# Altium schematic sheet Top Level.SchDoc: Cypress Molson - Top Level
size C; Author: George Cosens; CompanyName: Linear Systems Ltd.; DrawnBy: G. Cosens; Engineer: G. Cosens; Organization: Linear Systems Ltd.; Address1: 1-1717 Dublin Ave.; Address2: Winnipeg, MB, Canada; Address3: R3H 0H2; DocumentNumber: LS7652; Revision: 1; SheetNumber: 01; SheetTotal: 12
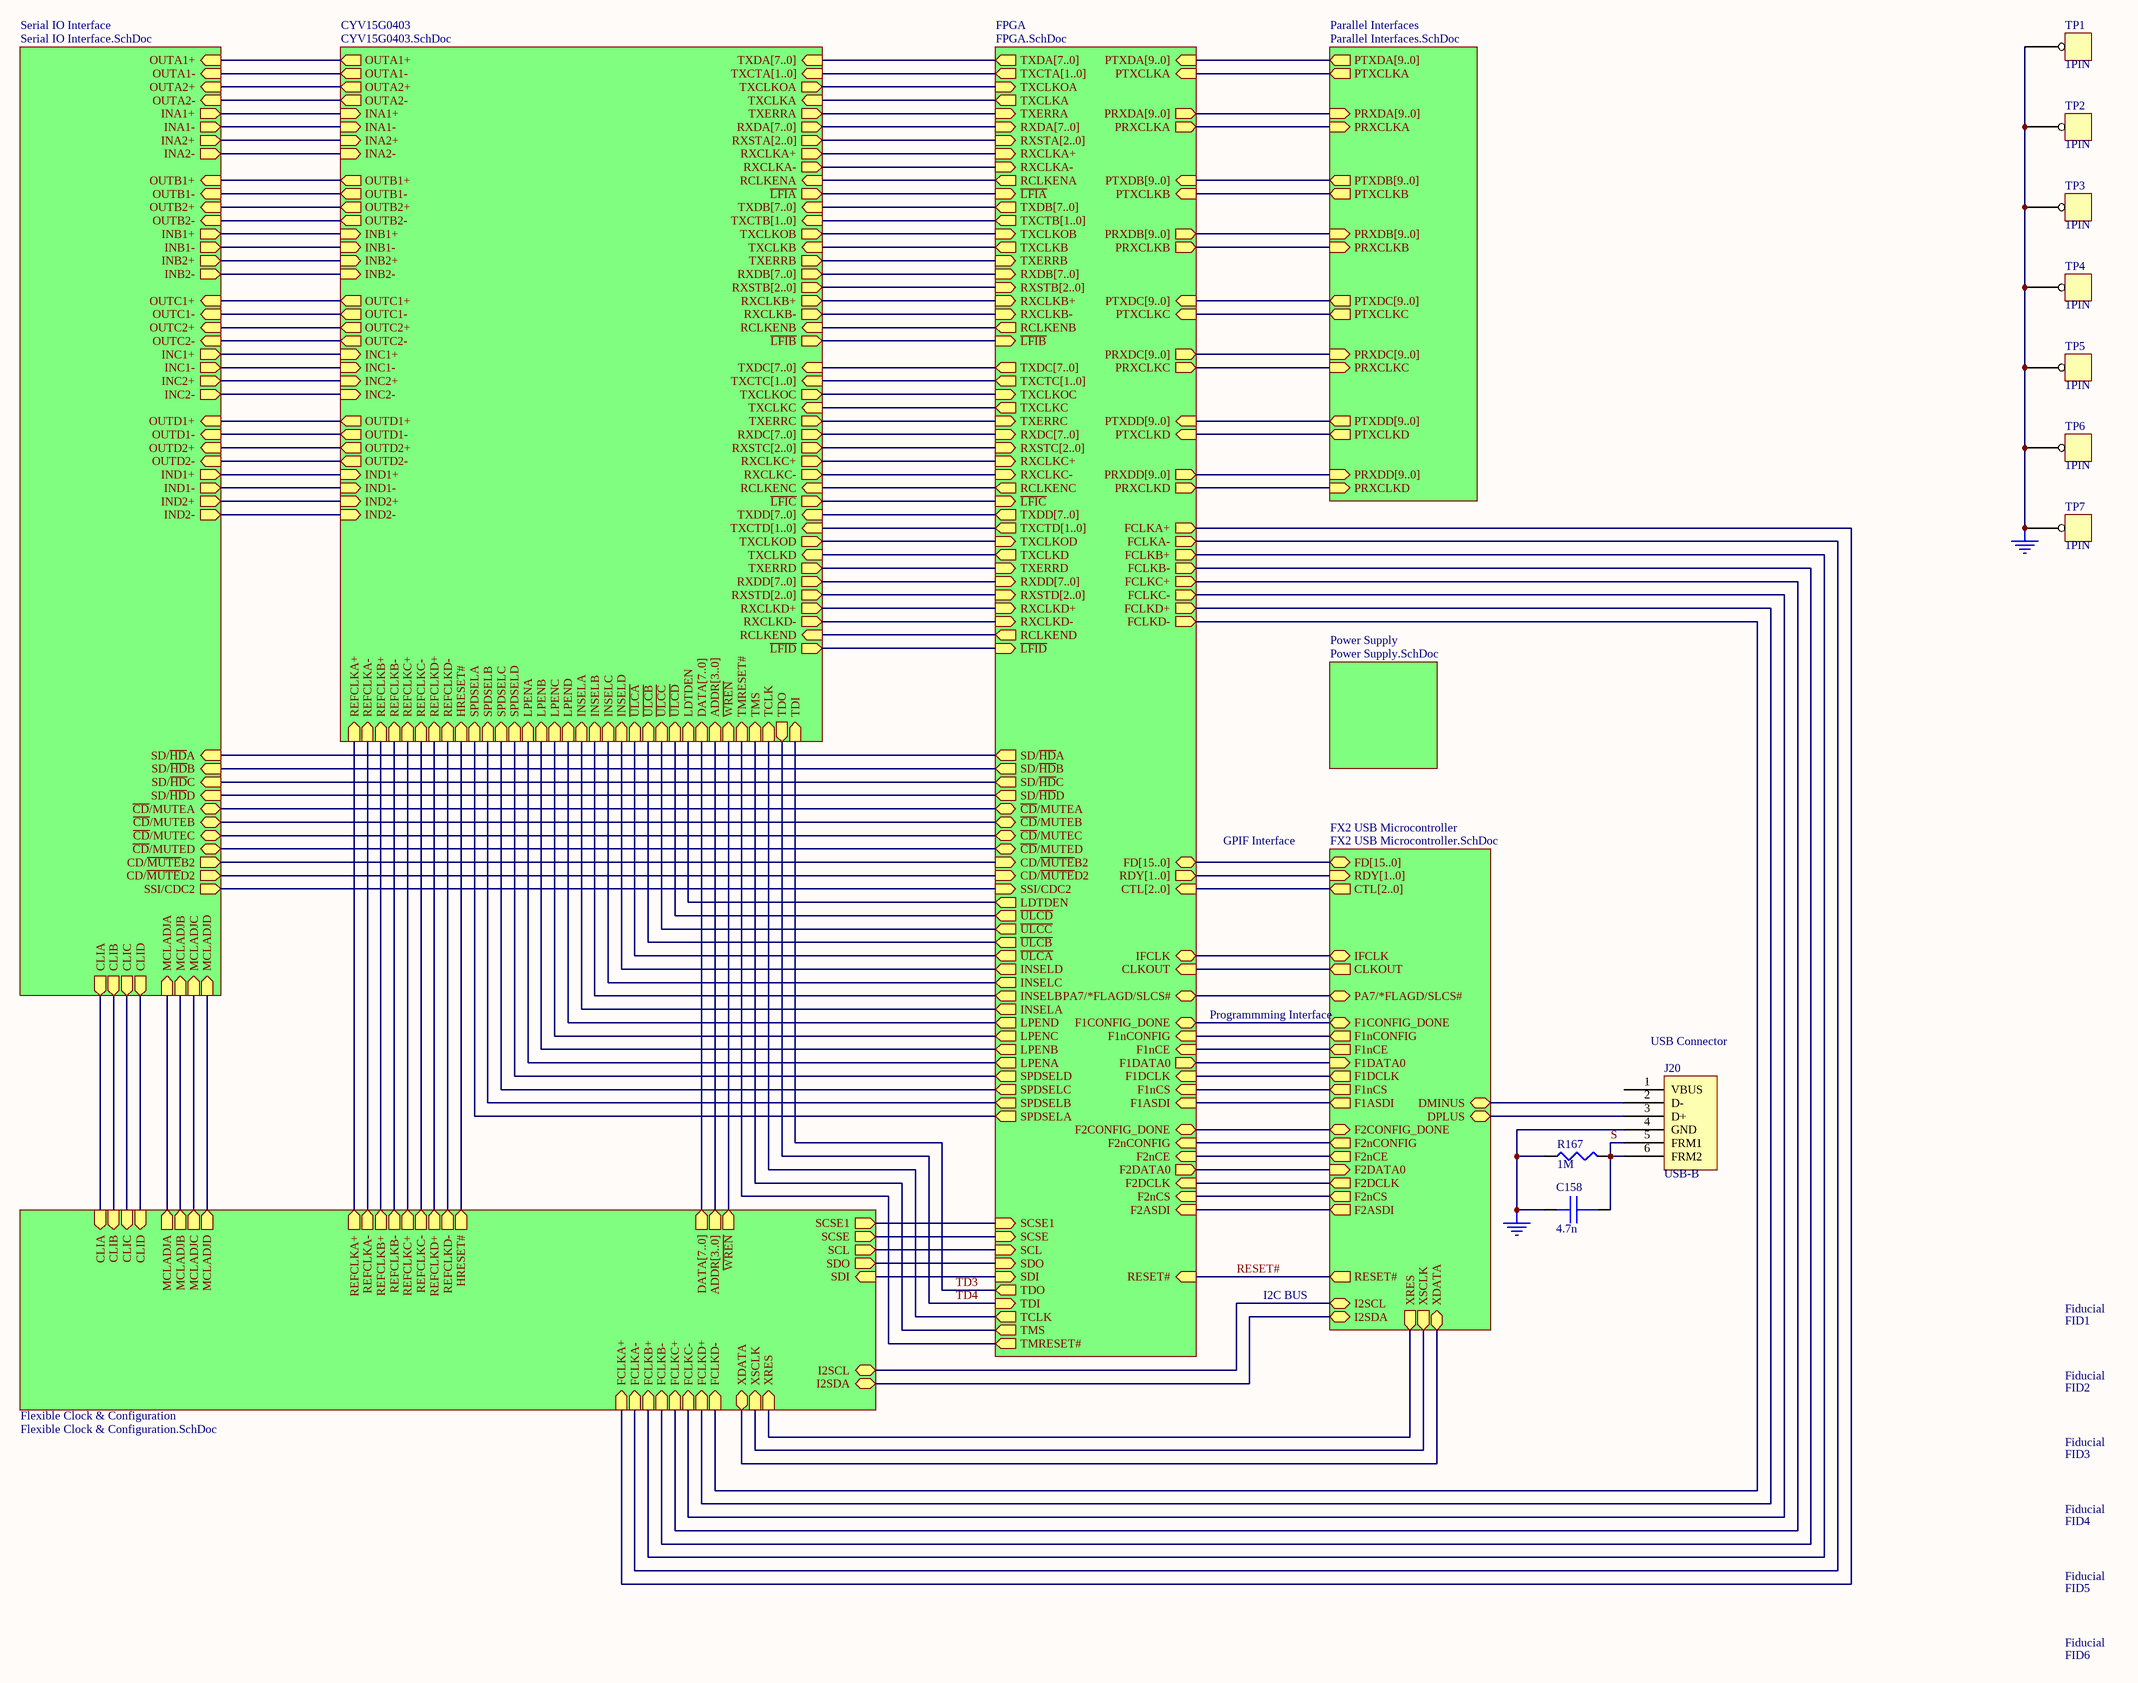
[diagram p0: Top Level.SchDoc]

## Parts
C158  (no value)  [0603]
FID1  FIDUCIAL  [FIDUCIAL]  (value not drawn)
FID2  FIDUCIAL  [FIDUCIAL]  (value not drawn)
FID3  FIDUCIAL  [FIDUCIAL]  (value not drawn)
FID4  FIDUCIAL  [FIDUCIAL]  (value not drawn)
FID5  FIDUCIAL  [FIDUCIAL]  (value not drawn)
FID6  FIDUCIAL  [FIDUCIAL]  (value not drawn)
J20  USB-B  [USB-B]
R167  1M  [0603]
TP1  1PIN  [1PIN]
TP2  1PIN  [1PIN]
TP3  1PIN  [1PIN]
TP4  1PIN  [1PIN]
TP5  1PIN  [1PIN]
TP6  1PIN  [1PIN]
TP7  1PIN  [1PIN]

## Sub-sheets
CYV15G0403 = CYV15G0403.SchDoc: OUTA1+ (out), OUTA1- (out), OUTA2+ (out), OUTA2- (out), INA1+ (in), INA1- (in), INA2+ (in), INA2- (in), OUTB1+ (out), OUTB1- (out), OUTB2- (out), OUTB2+ (out), INB1+ (in), INB1- (in), INB2+ (in), INB2- (in), OUTC1+ (out), OUTC1- (out), OUTC2+ (out), OUTC2- (out), INC1+ (in), INC1- (in), INC2+ (in), INC2- (in), OUTD1+ (out), OUTD1- (out), OUTD2+ (out), OUTD2- (out), IND1+ (in), IND1- (in), IND2+ (in), IND2- (in), TXDA[7..0] (in), TXDB[7..0] (in), TXDC[7..0] (in), TXDD[7..0] (in), TXCTA[1..0] (in), TXCTB[1..0] (in), TXCTC[1..0] (in), TXCTD[1..0] (in), RXDA[7..0] (out), RXDB[7..0] (out), RXDC[7..0] (out), RXDD[7..0] (out), RXSTA[2..0] (out), RXSTB[2..0] (out), RXSTC[2..0] (out), RXSTD[2..0] (out), TXCLKOA (out), TXCLKOB (out), TXCLKOC (out), TXCLKOD (out), RXCLKA+ (out), RXCLKA- (out), RXCLKB+ (out), RXCLKB- (out), RXCLKC+ (out), RXCLKC- (out), RXCLKD+ (out), RXCLKD- (out), TXCLKA (in), TXCLKB (in), TXCLKC (in), TXCLKD (in), REFCLKA+ (in), REFCLKB+ (in), REFCLKC+ (in), REFCLKD+ (in), HRESET# (in), SPDSELA (in), SPDSELB (in), SPDSELC (in), SPDSELD (in), LPENA (in), LPENC (in), LPENB (in), LPEND (in), INSELA (in), INSELB (in), INSELC (in), INSELD (in), ~{ULCA} (in), ~{ULCB} (in), ~{ULCC} (in), ~{ULCD} (in), LDTDEN (in), DATA[7..0] (in), ADDR[3..0] (in), ~{WREN} (in), ~{LFIA} (out), ~{LFIB} (out), ~{LFIC} (out), ~{LFID} (out), REFCLKB- (in), REFCLKC- (in), REFCLKD- (in), RCLKENA (in), RCLKENB (in), RCLKENC (in), RCLKEND (in), REFCLKA- (in), TMRESET# (in), TMS (in), TCLK (in), TDI (in), TDO (out), TXERRA (out), TXERRB (out), TXERRC (out), TXERRD (out)
Flexible Clock & Configuration = Flexible Clock & Configuration.SchDoc: CLIA (in), CLIB (in), CLIC (in), CLID (in), MCLADJA (out), MCLADJB (out), MCLADJC (out), MCLADJD (out), REFCLKA+ (out), REFCLKB+ (out), REFCLKC+ (out), REFCLKD+ (out), HRESET# (out), I2SCL (bidir), I2SDA (bidir), SCSE (out), SCL (out), SDO (out), SDI (in), DATA[7..0] (out), ADDR[3..0] (out), ~{WREN} (out), REFCLKA- (out), REFCLKB- (out), REFCLKC- (out), REFCLKD- (out), SCSE1 (out), XRES (in), XSCLK (in), XDATA (bidir), FCLKD- (in), FCLKD+ (in), FCLKC- (in), FCLKC+ (in), FCLKB- (in), FCLKB+ (in), FCLKA- (in), FCLKA+ (in)
FPGA = FPGA.SchDoc: TXDA[7..0] (out), TXDB[7..0] (out), TXDC[7..0] (out), TXDD[7..0] (out), TXCTA[1..0] (out), TXCTB[1..0] (out), TXCTC[1..0] (out), TXCTD[1..0] (out), TXCLKOA (in), TXCLKOB (in), TXCLKOC (in), TXCLKOD (in), TXCLKA (out), TXCLKB (out), TXCLKC (out), TXCLKD (out), RXDA[7..0] (in), RXDB[7..0] (in), RXDC[7..0] (in), RXDD[7..0] (in), RXSTA[2..0] (in), RXSTB[2..0] (in), RXSTC[2..0] (in), RXSTD[2..0] (in), RXCLKA+ (in), RXCLKB+ (in), RXCLKC+ (in), RXCLKD+ (in), RXCLKA- (in), RXCLKB- (in), RXCLKC- (in), RXCLKD- (in), SD/~{HD}A (out), SD/~{HD}B (out), SD/~{HD}C (out), SD/~{HD}D (out), ~{CD}/MUTEA (bidir), ~{CD}/MUTEB (bidir), ~{CD}/MUTEC (bidir), ~{CD}/MUTED (bidir), PTXDA[9..0] (in), PTXDB[9..0] (in), PTXDC[9..0] (in), PTXDD[9..0] (in), PRXDA[9..0] (out), PRXDB[9..0] (out), PRXDC[9..0] (out), PRXDD[9..0] (out), FD[15..0] (bidir), CTL[2..0] (in), RDY[1..0] (out), CLKOUT (in), IFCLK (bidir), ~{LFIA} (in), ~{LFIB} (in), ~{LFIC} (in), ~{LFID} (in), CD/~{MUTE}B2 (in), CD/~{MUTE}D2 (in), SSI/CDC2 (in), SDI (in), SDO (in), SCL (in), SCSE (in), F1ASDI (in), F1nCS (in), F1DCLK (in), F1nCE (in), F1nCONFIG (in), F1CONFIG_DONE (bidir), F1DATA0 (out), PA7/*FLAGD/SLCS# (bidir), RESET# (in), RCLKEND (out), RCLKENC (out), RCLKENB (out), RCLKENA (out), SPDSELA (out), SPDSELB (out), SPDSELC (out), SPDSELD (out), LPENA (out), LPENB (out), LPENC (out), LPEND (out), INSELA (out), INSELB (out), INSELC (out), INSELD (out), ~{ULCA} (out), ~{ULCB} (out), ~{ULCC} (out), ~{ULCD} (out), LDTDEN (out), PRXCLKA (out), PRXCLKB (out), PRXCLKC (out), PRXCLKD (out), PTXCLKA (in), PTXCLKB (in), PTXCLKC (in), PTXCLKD (in), F2CONFIG_DONE (bidir), F2nCONFIG (in), F2nCE (in), F2DATA0 (out), F2DCLK (in), F2nCS (in), F2ASDI (in), SCSE1 (in), TMS (out), TCLK (out), TMRESET# (out), TDO (out), TDI (in), TXERRA (in), TXERRB (in), TXERRC (in), TXERRD (in), FCLKA+ (out), FCLKA- (out), FCLKB+ (out), FCLKB- (out), FCLKC+ (out), FCLKC- (out), FCLKD+ (out), FCLKD- (out)
FX2 USB Microcontroller = FX2 USB Microcontroller.SchDoc: I2SDA (bidir), I2SCL (bidir), CTL[2..0] (out), RDY[1..0] (in), FD[15..0] (bidir), IFCLK (bidir), CLKOUT (out), DMINUS (bidir), DPLUS (bidir), PA7/*FLAGD/SLCS# (bidir), F1CONFIG_DONE (bidir), F1nCONFIG (out), F1nCE (out), F1DATA0 (in), F1DCLK (out), F1nCS (out), F1ASDI (out), RESET# (out), F2CONFIG_DONE (bidir), F2nCONFIG (out), F2nCE (out), F2DATA0 (in), F2DCLK (out), F2nCS (out), F2ASDI (out), XRES (out), XSCLK (out), XDATA (bidir)
Parallel Interfaces = Parallel Interfaces.SchDoc: PTXDA[9..0] (out), PTXDB[9..0] (out), PTXDC[9..0] (out), PTXDD[9..0] (out), PRXDA[9..0] (in), PRXDB[9..0] (in), PRXDC[9..0] (in), PRXDD[9..0] (in), PTXCLKA (out), PTXCLKB (out), PTXCLKC (out), PTXCLKD (out), PRXCLKA (in), PRXCLKB (in), PRXCLKC (in), PRXCLKD (in)
Power Supply = Power Supply.SchDoc: no entries
Serial IO Interface = Serial IO Interface.SchDoc: OUTA1+ (in), OUTA1- (in), OUTA2+ (in), OUTA2- (in), OUTB1+ (in), OUTB1- (in), OUTB2+ (in), OUTB2- (in), OUTC1+ (in), OUTC1- (in), OUTC2+ (in), OUTC2- (in), OUTD1+ (in), OUTD1- (in), OUTD2+ (in), OUTD2- (in), INA1+ (out), INA1- (out), INA2+ (out), INA2- (out), INB1+ (out), INB1- (out), INB2+ (out), INB2- (out), INC1+ (out), INC1- (out), INC2+ (out), INC2- (out), IND1+ (out), IND1- (out), IND2+ (out), IND2- (out), SD/~{HD}A (in), SD/~{HD}B (in), SD/~{HD}C (in), SD/~{HD}D (in), ~{CD}/MUTEB (bidir), ~{CD}/MUTEC (bidir), ~{CD}/MUTEA (bidir), ~{CD}/MUTED (bidir), MCLADJA (in), MCLADJB (in), MCLADJC (in), MCLADJD (in), CLIA (out), CLIB (out), CLIC (out), CLID (out), CD/~{MUTE}B2 (out), CD/~{MUTE}D2 (out), SSI/CDC2 (out)

## Nets
GND: C158.1 J20.4(GND) R167.1 TP1.1 TP2.1 TP3.1 TP4.1 TP5.1 TP6.1 TP7.1
RESET#: sheet FPGA/RESET#, sheet FX2 USB Microcontroller/RESET#
S: C158.2 J20.5(FRM1) J20.6(FRM2) R167.2
TD3: sheet CYV15G0403/TDI, sheet FPGA/TDO
TD4: sheet CYV15G0403/TDO, sheet FPGA/TDI
NetJ20_2: J20.2(D-) ; sheet FX2 USB Microcontroller/DMINUS
NetJ20_3: J20.3(D+) ; sheet FX2 USB Microcontroller/DPLUS
(unnamed): sheet CYV15G0403/OUTA1+, sheet Serial IO Interface/OUTA1+
(unnamed): sheet CYV15G0403/OUTA1-, sheet Serial IO Interface/OUTA1-
(unnamed): sheet CYV15G0403/OUTA2+, sheet Serial IO Interface/OUTA2+
(unnamed): sheet CYV15G0403/OUTA2-, sheet Serial IO Interface/OUTA2-
(unnamed): sheet CYV15G0403/INA1+, sheet Serial IO Interface/INA1+
(unnamed): sheet CYV15G0403/INA1-, sheet Serial IO Interface/INA1-
(unnamed): sheet CYV15G0403/INA2+, sheet Serial IO Interface/INA2+
(unnamed): sheet CYV15G0403/INA2-, sheet Serial IO Interface/INA2-
(unnamed): sheet CYV15G0403/OUTB1+, sheet Serial IO Interface/OUTB1+
(unnamed): sheet CYV15G0403/OUTB1-, sheet Serial IO Interface/OUTB1-
(unnamed): sheet CYV15G0403/OUTB2-, sheet Serial IO Interface/OUTB2-
(unnamed): sheet CYV15G0403/OUTB2+, sheet Serial IO Interface/OUTB2+
(unnamed): sheet CYV15G0403/INB1+, sheet Serial IO Interface/INB1+
(unnamed): sheet CYV15G0403/INB1-, sheet Serial IO Interface/INB1-
(unnamed): sheet CYV15G0403/INB2+, sheet Serial IO Interface/INB2+
(unnamed): sheet CYV15G0403/INB2-, sheet Serial IO Interface/INB2-
(unnamed): sheet CYV15G0403/OUTC1+, sheet Serial IO Interface/OUTC1+
(unnamed): sheet CYV15G0403/OUTC1-, sheet Serial IO Interface/OUTC1-
(unnamed): sheet CYV15G0403/OUTC2+, sheet Serial IO Interface/OUTC2+
(unnamed): sheet CYV15G0403/OUTC2-, sheet Serial IO Interface/OUTC2-
(unnamed): sheet CYV15G0403/INC1+, sheet Serial IO Interface/INC1+
(unnamed): sheet CYV15G0403/INC1-, sheet Serial IO Interface/INC1-
(unnamed): sheet CYV15G0403/INC2+, sheet Serial IO Interface/INC2+
(unnamed): sheet CYV15G0403/INC2-, sheet Serial IO Interface/INC2-
(unnamed): sheet CYV15G0403/OUTD1+, sheet Serial IO Interface/OUTD1+
(unnamed): sheet CYV15G0403/OUTD1-, sheet Serial IO Interface/OUTD1-
(unnamed): sheet CYV15G0403/OUTD2+, sheet Serial IO Interface/OUTD2+
(unnamed): sheet CYV15G0403/OUTD2-, sheet Serial IO Interface/OUTD2-
(unnamed): sheet CYV15G0403/IND1+, sheet Serial IO Interface/IND1+
(unnamed): sheet CYV15G0403/IND1-, sheet Serial IO Interface/IND1-
(unnamed): sheet CYV15G0403/IND2+, sheet Serial IO Interface/IND2+
(unnamed): sheet CYV15G0403/IND2-, sheet Serial IO Interface/IND2-
(unnamed): sheet CYV15G0403/TXCLKOA, sheet FPGA/TXCLKOA
(unnamed): sheet CYV15G0403/TXCLKOB, sheet FPGA/TXCLKOB
(unnamed): sheet CYV15G0403/TXCLKOC, sheet FPGA/TXCLKOC
(unnamed): sheet CYV15G0403/TXCLKOD, sheet FPGA/TXCLKOD
(unnamed): sheet CYV15G0403/RXCLKA+, sheet FPGA/RXCLKA+
(unnamed): sheet CYV15G0403/RXCLKA-, sheet FPGA/RXCLKA-
(unnamed): sheet CYV15G0403/RXCLKB+, sheet FPGA/RXCLKB+
(unnamed): sheet CYV15G0403/RXCLKB-, sheet FPGA/RXCLKB-
(unnamed): sheet CYV15G0403/RXCLKC+, sheet FPGA/RXCLKC+
(unnamed): sheet CYV15G0403/RXCLKC-, sheet FPGA/RXCLKC-
(unnamed): sheet CYV15G0403/RXCLKD+, sheet FPGA/RXCLKD+
(unnamed): sheet CYV15G0403/RXCLKD-, sheet FPGA/RXCLKD-
(unnamed): sheet CYV15G0403/TXCLKA, sheet FPGA/TXCLKA
(unnamed): sheet CYV15G0403/TXCLKB, sheet FPGA/TXCLKB
(unnamed): sheet CYV15G0403/TXCLKC, sheet FPGA/TXCLKC
(unnamed): sheet CYV15G0403/TXCLKD, sheet FPGA/TXCLKD
(unnamed): sheet CYV15G0403/REFCLKA+, sheet Flexible Clock & Configuration/REFCLKA+
(unnamed): sheet CYV15G0403/REFCLKB+, sheet Flexible Clock & Configuration/REFCLKB+
(unnamed): sheet CYV15G0403/REFCLKC+, sheet Flexible Clock & Configuration/REFCLKC+
(unnamed): sheet CYV15G0403/REFCLKD+, sheet Flexible Clock & Configuration/REFCLKD+
(unnamed): sheet CYV15G0403/HRESET#, sheet Flexible Clock & Configuration/HRESET#
(unnamed): sheet CYV15G0403/SPDSELA, sheet FPGA/SPDSELA
(unnamed): sheet CYV15G0403/SPDSELB, sheet FPGA/SPDSELB
(unnamed): sheet CYV15G0403/SPDSELC, sheet FPGA/SPDSELC
(unnamed): sheet CYV15G0403/SPDSELD, sheet FPGA/SPDSELD
(unnamed): sheet CYV15G0403/LPENA, sheet FPGA/LPENA
(unnamed): sheet CYV15G0403/LPENC, sheet FPGA/LPENC
(unnamed): sheet CYV15G0403/LPENB, sheet FPGA/LPENB
(unnamed): sheet CYV15G0403/LPEND, sheet FPGA/LPEND
(unnamed): sheet CYV15G0403/INSELA, sheet FPGA/INSELA
(unnamed): sheet CYV15G0403/INSELB, sheet FPGA/INSELB
(unnamed): sheet CYV15G0403/INSELC, sheet FPGA/INSELC
(unnamed): sheet CYV15G0403/INSELD, sheet FPGA/INSELD
(unnamed): sheet CYV15G0403/~{ULCA}, sheet FPGA/~{ULCA}
(unnamed): sheet CYV15G0403/~{ULCB}, sheet FPGA/~{ULCB}
(unnamed): sheet CYV15G0403/~{ULCC}, sheet FPGA/~{ULCC}
(unnamed): sheet CYV15G0403/~{ULCD}, sheet FPGA/~{ULCD}
(unnamed): sheet CYV15G0403/LDTDEN, sheet FPGA/LDTDEN
(unnamed): sheet CYV15G0403/~{WREN}, sheet Flexible Clock & Configuration/~{WREN}
(unnamed): sheet CYV15G0403/~{LFIA}, sheet FPGA/~{LFIA}
(unnamed): sheet CYV15G0403/~{LFIB}, sheet FPGA/~{LFIB}
(unnamed): sheet CYV15G0403/~{LFIC}, sheet FPGA/~{LFIC}
(unnamed): sheet CYV15G0403/~{LFID}, sheet FPGA/~{LFID}
(unnamed): sheet CYV15G0403/REFCLKB-, sheet Flexible Clock & Configuration/REFCLKB-
(unnamed): sheet CYV15G0403/REFCLKC-, sheet Flexible Clock & Configuration/REFCLKC-
(unnamed): sheet CYV15G0403/REFCLKD-, sheet Flexible Clock & Configuration/REFCLKD-
(unnamed): sheet CYV15G0403/RCLKENA, sheet FPGA/RCLKENA
(unnamed): sheet CYV15G0403/RCLKENB, sheet FPGA/RCLKENB
(unnamed): sheet CYV15G0403/RCLKENC, sheet FPGA/RCLKENC
(unnamed): sheet CYV15G0403/RCLKEND, sheet FPGA/RCLKEND
(unnamed): sheet CYV15G0403/REFCLKA-, sheet Flexible Clock & Configuration/REFCLKA-
(unnamed): sheet CYV15G0403/TMRESET#, sheet FPGA/TMRESET#
(unnamed): sheet CYV15G0403/TMS, sheet FPGA/TMS
(unnamed): sheet CYV15G0403/TCLK, sheet FPGA/TCLK
(unnamed): sheet CYV15G0403/TXERRA, sheet FPGA/TXERRA
(unnamed): sheet CYV15G0403/TXERRB, sheet FPGA/TXERRB
(unnamed): sheet CYV15G0403/TXERRC, sheet FPGA/TXERRC
(unnamed): sheet CYV15G0403/TXERRD, sheet FPGA/TXERRD
(unnamed): sheet FPGA/SD/~{HD}A, sheet Serial IO Interface/SD/~{HD}A
(unnamed): sheet FPGA/SD/~{HD}B, sheet Serial IO Interface/SD/~{HD}B
(unnamed): sheet FPGA/SD/~{HD}C, sheet Serial IO Interface/SD/~{HD}C
(unnamed): sheet FPGA/SD/~{HD}D, sheet Serial IO Interface/SD/~{HD}D
(unnamed): sheet FPGA/~{CD}/MUTEA, sheet Serial IO Interface/~{CD}/MUTEA
(unnamed): sheet FPGA/~{CD}/MUTEB, sheet Serial IO Interface/~{CD}/MUTEB
(unnamed): sheet FPGA/~{CD}/MUTEC, sheet Serial IO Interface/~{CD}/MUTEC
(unnamed): sheet FPGA/~{CD}/MUTED, sheet Serial IO Interface/~{CD}/MUTED
(unnamed): sheet FPGA/CLKOUT, sheet FX2 USB Microcontroller/CLKOUT
(unnamed): sheet FPGA/IFCLK, sheet FX2 USB Microcontroller/IFCLK
(unnamed): sheet FPGA/CD/~{MUTE}B2, sheet Serial IO Interface/CD/~{MUTE}B2
(unnamed): sheet FPGA/CD/~{MUTE}D2, sheet Serial IO Interface/CD/~{MUTE}D2
(unnamed): sheet FPGA/SSI/CDC2, sheet Serial IO Interface/SSI/CDC2
(unnamed): sheet FPGA/SDI, sheet Flexible Clock & Configuration/SDI
(unnamed): sheet FPGA/SDO, sheet Flexible Clock & Configuration/SDO
(unnamed): sheet FPGA/SCL, sheet Flexible Clock & Configuration/SCL
(unnamed): sheet FPGA/SCSE, sheet Flexible Clock & Configuration/SCSE
(unnamed): sheet FPGA/F1ASDI, sheet FX2 USB Microcontroller/F1ASDI
(unnamed): sheet FPGA/F1nCS, sheet FX2 USB Microcontroller/F1nCS
(unnamed): sheet FPGA/F1DCLK, sheet FX2 USB Microcontroller/F1DCLK
(unnamed): sheet FPGA/F1nCE, sheet FX2 USB Microcontroller/F1nCE
(unnamed): sheet FPGA/F1nCONFIG, sheet FX2 USB Microcontroller/F1nCONFIG
(unnamed): sheet FPGA/F1CONFIG_DONE, sheet FX2 USB Microcontroller/F1CONFIG_DONE
(unnamed): sheet FPGA/F1DATA0, sheet FX2 USB Microcontroller/F1DATA0
(unnamed): sheet FPGA/PA7/*FLAGD/SLCS#, sheet FX2 USB Microcontroller/PA7/*FLAGD/SLCS#
(unnamed): sheet FPGA/PRXCLKA, sheet Parallel Interfaces/PRXCLKA
(unnamed): sheet FPGA/PRXCLKB, sheet Parallel Interfaces/PRXCLKB
(unnamed): sheet FPGA/PRXCLKC, sheet Parallel Interfaces/PRXCLKC
(unnamed): sheet FPGA/PRXCLKD, sheet Parallel Interfaces/PRXCLKD
(unnamed): sheet FPGA/PTXCLKA, sheet Parallel Interfaces/PTXCLKA
(unnamed): sheet FPGA/PTXCLKB, sheet Parallel Interfaces/PTXCLKB
(unnamed): sheet FPGA/PTXCLKC, sheet Parallel Interfaces/PTXCLKC
(unnamed): sheet FPGA/PTXCLKD, sheet Parallel Interfaces/PTXCLKD
(unnamed): sheet FPGA/F2CONFIG_DONE, sheet FX2 USB Microcontroller/F2CONFIG_DONE
(unnamed): sheet FPGA/F2nCONFIG, sheet FX2 USB Microcontroller/F2nCONFIG
(unnamed): sheet FPGA/F2nCE, sheet FX2 USB Microcontroller/F2nCE
(unnamed): sheet FPGA/F2DATA0, sheet FX2 USB Microcontroller/F2DATA0
(unnamed): sheet FPGA/F2DCLK, sheet FX2 USB Microcontroller/F2DCLK
(unnamed): sheet FPGA/F2nCS, sheet FX2 USB Microcontroller/F2nCS
(unnamed): sheet FPGA/F2ASDI, sheet FX2 USB Microcontroller/F2ASDI
(unnamed): sheet FPGA/SCSE1, sheet Flexible Clock & Configuration/SCSE1
(unnamed): sheet FPGA/FCLKA+, sheet Flexible Clock & Configuration/FCLKA+
(unnamed): sheet FPGA/FCLKA-, sheet Flexible Clock & Configuration/FCLKA-
(unnamed): sheet FPGA/FCLKB+, sheet Flexible Clock & Configuration/FCLKB+
(unnamed): sheet FPGA/FCLKB-, sheet Flexible Clock & Configuration/FCLKB-
(unnamed): sheet FPGA/FCLKC+, sheet Flexible Clock & Configuration/FCLKC+
(unnamed): sheet FPGA/FCLKC-, sheet Flexible Clock & Configuration/FCLKC-
(unnamed): sheet FPGA/FCLKD+, sheet Flexible Clock & Configuration/FCLKD+
(unnamed): sheet FPGA/FCLKD-, sheet Flexible Clock & Configuration/FCLKD-
(unnamed): sheet Flexible Clock & Configuration/CLIA, sheet Serial IO Interface/CLIA
(unnamed): sheet Flexible Clock & Configuration/CLIB, sheet Serial IO Interface/CLIB
(unnamed): sheet Flexible Clock & Configuration/CLIC, sheet Serial IO Interface/CLIC
(unnamed): sheet Flexible Clock & Configuration/CLID, sheet Serial IO Interface/CLID
(unnamed): sheet Flexible Clock & Configuration/MCLADJA, sheet Serial IO Interface/MCLADJA
(unnamed): sheet Flexible Clock & Configuration/MCLADJB, sheet Serial IO Interface/MCLADJB
(unnamed): sheet Flexible Clock & Configuration/MCLADJC, sheet Serial IO Interface/MCLADJC
(unnamed): sheet Flexible Clock & Configuration/MCLADJD, sheet Serial IO Interface/MCLADJD
(unnamed): sheet Flexible Clock & Configuration/I2SCL, sheet FX2 USB Microcontroller/I2SCL
(unnamed): sheet Flexible Clock & Configuration/I2SDA, sheet FX2 USB Microcontroller/I2SDA
(unnamed): sheet Flexible Clock & Configuration/XRES, sheet FX2 USB Microcontroller/XRES
(unnamed): sheet Flexible Clock & Configuration/XSCLK, sheet FX2 USB Microcontroller/XSCLK
(unnamed): sheet Flexible Clock & Configuration/XDATA, sheet FX2 USB Microcontroller/XDATA

Not connected (* = marked no-connect by the designer): J20 1(VBUS)

## Buses and harness runs
bus sheet CYV15G0403/ADDR[3..0] = sheet Flexible Clock & Configuration/ADDR[3..0]
bus sheet CYV15G0403/DATA[7..0] = sheet Flexible Clock & Configuration/DATA[7..0]
bus sheet CYV15G0403/RXDA[7..0] = sheet FPGA/RXDA[7..0]
bus sheet CYV15G0403/RXDB[7..0] = sheet FPGA/RXDB[7..0]
bus sheet CYV15G0403/RXDC[7..0] = sheet FPGA/RXDC[7..0]
bus sheet CYV15G0403/RXDD[7..0] = sheet FPGA/RXDD[7..0]
bus sheet CYV15G0403/RXSTA[2..0] = sheet FPGA/RXSTA[2..0]
bus sheet CYV15G0403/RXSTB[2..0] = sheet FPGA/RXSTB[2..0]
bus sheet CYV15G0403/RXSTC[2..0] = sheet FPGA/RXSTC[2..0]
bus sheet CYV15G0403/RXSTD[2..0] = sheet FPGA/RXSTD[2..0]
bus sheet CYV15G0403/TXCTA[1..0] = sheet FPGA/TXCTA[1..0]
bus sheet CYV15G0403/TXCTB[1..0] = sheet FPGA/TXCTB[1..0]
bus sheet CYV15G0403/TXCTC[1..0] = sheet FPGA/TXCTC[1..0]
bus sheet CYV15G0403/TXCTD[1..0] = sheet FPGA/TXCTD[1..0]
bus sheet CYV15G0403/TXDA[7..0] = sheet FPGA/TXDA[7..0]
bus sheet CYV15G0403/TXDB[7..0] = sheet FPGA/TXDB[7..0]
bus sheet CYV15G0403/TXDC[7..0] = sheet FPGA/TXDC[7..0]
bus sheet CYV15G0403/TXDD[7..0] = sheet FPGA/TXDD[7..0]
bus sheet FPGA/CTL[2..0] = sheet FX2 USB Microcontroller/CTL[2..0]
bus sheet FPGA/FD[15..0] = sheet FX2 USB Microcontroller/FD[15..0]
bus sheet FPGA/PRXDA[9..0] = sheet Parallel Interfaces/PRXDA[9..0]
bus sheet FPGA/PRXDB[9..0] = sheet Parallel Interfaces/PRXDB[9..0]
bus sheet FPGA/PRXDC[9..0] = sheet Parallel Interfaces/PRXDC[9..0]
bus sheet FPGA/PRXDD[9..0] = sheet Parallel Interfaces/PRXDD[9..0]
bus sheet FPGA/PTXDA[9..0] = sheet Parallel Interfaces/PTXDA[9..0]
bus sheet FPGA/PTXDB[9..0] = sheet Parallel Interfaces/PTXDB[9..0]
bus sheet FPGA/PTXDC[9..0] = sheet Parallel Interfaces/PTXDC[9..0]
bus sheet FPGA/PTXDD[9..0] = sheet Parallel Interfaces/PTXDD[9..0]
bus sheet FPGA/RDY[1..0] = sheet FX2 USB Microcontroller/RDY[1..0]

## Notes on the sheet
- GPIF Interface
- Programmming Interface
- (near J20) USB Connector
- I2C BUS
- Size
- Date:
- File:
- C
- Drawing Number
- Sheet
- Drawn By:
- G. Cosens
- Revision
- of
- (in symbol FIDUCIAL) Fiducial

## Library data of the parts
C158 = CAP: SMT CAP
FID1-FID6 = FIDUCIAL: Fiducial mark
J20 = USB-B: Universal Serial Bus Type B Receptacle; Text Field1: 40; Text Field2: 70
R167 = RES1